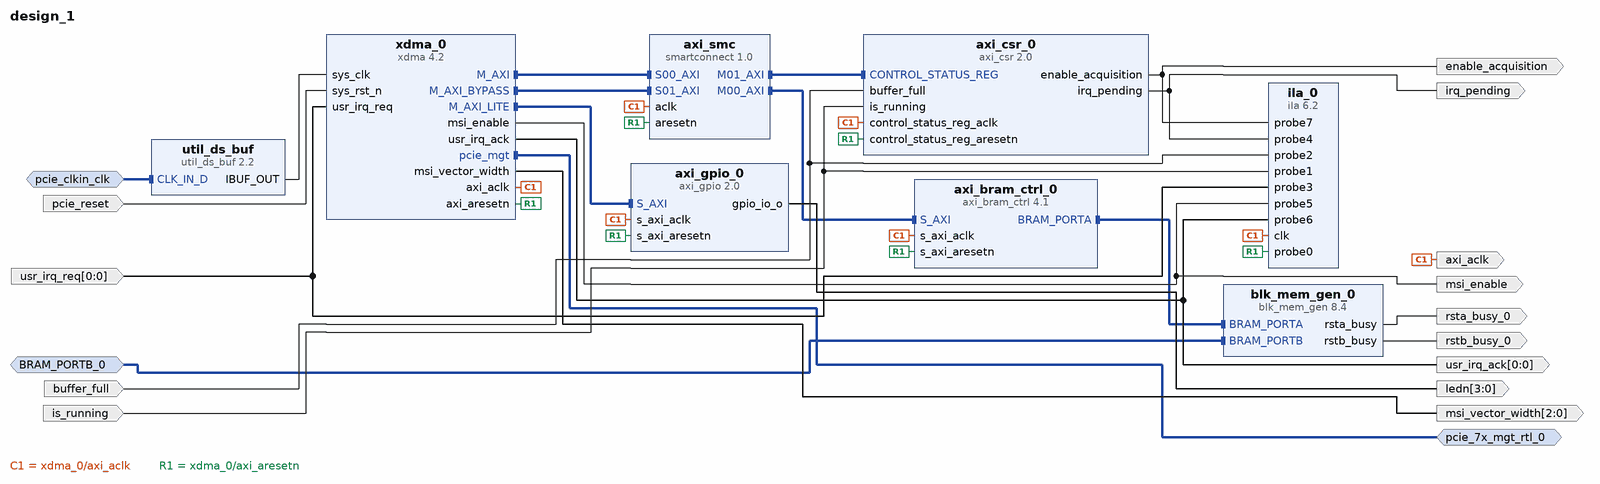
[diagram p0: block diagram of the top level]
# Vivado block design design_1, xc7a100tfgg484-2, Vivado 2025.2
create_bd_design design_1

create_bd_intf_port -mode Master -vlnv xilinx.com:interface:pcie_7x_mgt_rtl:1.0 pcie_7x_mgt_rtl_0
create_bd_intf_port -mode Slave -vlnv xilinx.com:interface:diff_clock_rtl:1.0 pcie_clkin_clk
set_property -dict {CONFIG.FREQ_HZ 100000000} [get_bd_intf_ports pcie_clkin_clk]
create_bd_intf_port -mode Slave -vlnv xilinx.com:interface:bram_rtl:1.0 BRAM_PORTB_0
set_property -dict {CONFIG.MASTER_TYPE BRAM_CTRL CONFIG.READ_WRITE_MODE READ_WRITE} [get_bd_intf_ports BRAM_PORTB_0]
create_bd_port -dir I -type rst pcie_reset
set_property -dict {CONFIG.POLARITY ACTIVE_LOW} [get_bd_ports pcie_reset]
create_bd_port -dir O -from 3 -to 0 -type data ledn
create_bd_port -dir O -type clk axi_aclk
create_bd_port -dir O enable_acquisition
create_bd_port -dir I is_running
create_bd_port -dir I buffer_full
create_bd_port -dir O rsta_busy_0
create_bd_port -dir O rstb_busy_0
create_bd_port -dir I -from 0 -to 0 -type intr usr_irq_req
set_property -dict {CONFIG.PortWidth 1} [get_bd_ports usr_irq_req]
create_bd_port -dir O -from 0 -to 0 usr_irq_ack
create_bd_port -dir O msi_enable
create_bd_port -dir O -from 2 -to 0 -type data msi_vector_width
create_bd_port -dir O irq_pending

create_bd_cell -type ip -vlnv xilinx.com:ip:xdma:4.2 xdma_0
set_property -dict [list \
  CONFIG.axi_data_width 64_bit \
  CONFIG.axilite_master_en true \
  CONFIG.axist_bypass_en true \
  CONFIG.axist_bypass_scale Megabytes \
  CONFIG.axist_bypass_size 1 \
  CONFIG.axisten_freq 250 \
  CONFIG.cfg_mgmt_if false \
  CONFIG.enable_gtwizard false \
  CONFIG.pciebar2axibar_axist_bypass 0x44A0_0000 \
  CONFIG.pf0_class_code_base FF \
  CONFIG.pf0_class_code_interface 00 \
  CONFIG.pf0_class_code_sub 00 \
  CONFIG.pf0_device_id 7021 \
  CONFIG.pf0_interrupt_pin NONE \
  CONFIG.pl_link_cap_max_link_speed 5.0_GT/s \
  CONFIG.pl_link_cap_max_link_width X4 \
  CONFIG.plltype QPLL1 \
  CONFIG.ref_clk_freq 100_MHz \
  CONFIG.xdma_axi_intf_mm AXI_Memory_Mapped \
  CONFIG.xdma_rnum_chnl 1 \
  CONFIG.xdma_wnum_chnl 1 \
] [get_bd_cells xdma_0]
create_bd_cell -type ip -vlnv xilinx.com:ip:axi_gpio:2.0 axi_gpio_0
set_property -dict {CONFIG.C_ALL_OUTPUTS 1 CONFIG.C_DOUT_DEFAULT 0x00000101 CONFIG.C_GPIO_WIDTH 4} [get_bd_cells axi_gpio_0]
create_bd_cell -type ip -vlnv xilinx.com:ip:util_ds_buf:2.2 util_ds_buf
set_property -dict {CONFIG.C_BUF_TYPE IBUFDSGTE} [get_bd_cells util_ds_buf]
create_bd_cell -type ip -vlnv xilinx.com:ip:axi_bram_ctrl:4.1 axi_bram_ctrl_0
set_property -dict {CONFIG.SINGLE_PORT_BRAM 1} [get_bd_cells axi_bram_ctrl_0]
create_bd_cell -type ip -vlnv xilinx.com:ip:blk_mem_gen:8.4 blk_mem_gen_0
set_property -dict {CONFIG.Memory_Type True_Dual_Port_RAM} [get_bd_cells blk_mem_gen_0]
create_bd_cell -type ip -vlnv xilinx.com:ip:smartconnect:1.0 axi_smc
set_property -dict {CONFIG.NUM_MI 2 CONFIG.NUM_SI 2} [get_bd_cells axi_smc]
create_bd_cell -type ip -vlnv Nizar_Homebrew:user:axi_csr:2.0 axi_csr_0
create_bd_cell -type ip -vlnv xilinx.com:ip:ila:6.2 ila_0
set_property -dict {CONFIG.C_MONITOR_TYPE Native CONFIG.C_NUM_OF_PROBES 8} [get_bd_cells ila_0]

# ---- connections ----

connect_bd_intf_net -intf_net BRAM_PORTB_0_1 [get_bd_intf_ports BRAM_PORTB_0] [get_bd_intf_pins blk_mem_gen_0/BRAM_PORTB]
connect_bd_intf_net [get_bd_intf_pins blk_mem_gen_0/BRAM_PORTA] [get_bd_intf_pins axi_bram_ctrl_0/BRAM_PORTA]
connect_bd_intf_net [get_bd_intf_pins axi_smc/M00_AXI] [get_bd_intf_pins axi_bram_ctrl_0/S_AXI]
connect_bd_intf_net [get_bd_intf_pins axi_smc/M01_AXI] [get_bd_intf_pins axi_csr_0/CONTROL_STATUS_REG]
connect_bd_intf_net -intf_net diff_clock_rtl_0_1 [get_bd_intf_ports pcie_clkin_clk] [get_bd_intf_pins util_ds_buf/CLK_IN_D]
connect_bd_intf_net [get_bd_intf_pins xdma_0/M_AXI] [get_bd_intf_pins axi_smc/S00_AXI]
connect_bd_intf_net [get_bd_intf_pins xdma_0/M_AXI_BYPASS] [get_bd_intf_pins axi_smc/S01_AXI]
connect_bd_intf_net [get_bd_intf_pins xdma_0/M_AXI_LITE] [get_bd_intf_pins axi_gpio_0/S_AXI]
connect_bd_intf_net [get_bd_intf_ports pcie_7x_mgt_rtl_0] [get_bd_intf_pins xdma_0/pcie_mgt]
connect_bd_net [get_bd_pins axi_csr_0/enable_acquisition] [get_bd_ports enable_acquisition] [get_bd_pins ila_0/probe7]
connect_bd_net [get_bd_pins axi_csr_0/irq_pending] [get_bd_ports irq_pending] [get_bd_pins ila_0/probe4]
connect_bd_net [get_bd_pins axi_gpio_0/gpio_io_o] [get_bd_ports ledn]
connect_bd_net [get_bd_pins blk_mem_gen_0/rsta_busy] [get_bd_ports rsta_busy_0]
connect_bd_net [get_bd_pins blk_mem_gen_0/rstb_busy] [get_bd_ports rstb_busy_0]
connect_bd_net -net buffer_full_0_1 [get_bd_ports buffer_full] [get_bd_pins axi_csr_0/buffer_full] [get_bd_pins ila_0/probe2]
connect_bd_net -net is_running_0_1 [get_bd_ports is_running] [get_bd_pins axi_csr_0/is_running] [get_bd_pins ila_0/probe1]
connect_bd_net -net reset_rtl_0_1 [get_bd_ports pcie_reset] [get_bd_pins xdma_0/sys_rst_n]
connect_bd_net [get_bd_ports usr_irq_req] [get_bd_pins xdma_0/usr_irq_req] [get_bd_pins ila_0/probe3]
connect_bd_net [get_bd_pins util_ds_buf/IBUF_OUT] [get_bd_pins xdma_0/sys_clk]
connect_bd_net [get_bd_pins xdma_0/axi_aclk] \
  [get_bd_pins axi_gpio_0/s_axi_aclk] [get_bd_pins axi_smc/aclk] [get_bd_pins axi_bram_ctrl_0/s_axi_aclk] \
  [get_bd_ports axi_aclk] [get_bd_pins axi_csr_0/control_status_reg_aclk] [get_bd_pins ila_0/clk]
connect_bd_net [get_bd_pins xdma_0/axi_aresetn] \
  [get_bd_pins axi_gpio_0/s_axi_aresetn] [get_bd_pins axi_bram_ctrl_0/s_axi_aresetn] [get_bd_pins axi_smc/aresetn] \
  [get_bd_pins axi_csr_0/control_status_reg_aresetn] [get_bd_pins ila_0/probe0]
connect_bd_net [get_bd_pins xdma_0/msi_enable] [get_bd_ports msi_enable] [get_bd_pins ila_0/probe5]
connect_bd_net [get_bd_pins xdma_0/msi_vector_width] [get_bd_ports msi_vector_width]
connect_bd_net [get_bd_pins xdma_0/usr_irq_ack] [get_bd_ports usr_irq_ack] [get_bd_pins ila_0/probe6]

# ---- address map ----
assign_bd_address -offset 0x0000000044A00000 -range 128 -target_address_space [get_bd_addr_spaces xdma_0/M_AXI] [get_bd_addr_segs axi_csr_0/CONTROL_STATUS_REG/CONTROL_STATUS_REG_reg]
assign_bd_address -offset 0x0000000044A02000 -range 8K -target_address_space [get_bd_addr_spaces xdma_0/M_AXI] [get_bd_addr_segs axi_bram_ctrl_0/S_AXI/Mem0]
assign_bd_address -offset 0x0000000044A00000 -range 128 -target_address_space [get_bd_addr_spaces xdma_0/M_AXI_BYPASS] [get_bd_addr_segs axi_csr_0/CONTROL_STATUS_REG/CONTROL_STATUS_REG_reg]
assign_bd_address -offset 0x0000000044A02000 -range 8K -target_address_space [get_bd_addr_spaces xdma_0/M_AXI_BYPASS] [get_bd_addr_segs axi_bram_ctrl_0/S_AXI/Mem0]
assign_bd_address -offset 0x00000000 -range 64K -target_address_space [get_bd_addr_spaces xdma_0/M_AXI_LITE] [get_bd_addr_segs axi_gpio_0/S_AXI/Reg]

validate_bd_design
save_bd_design
